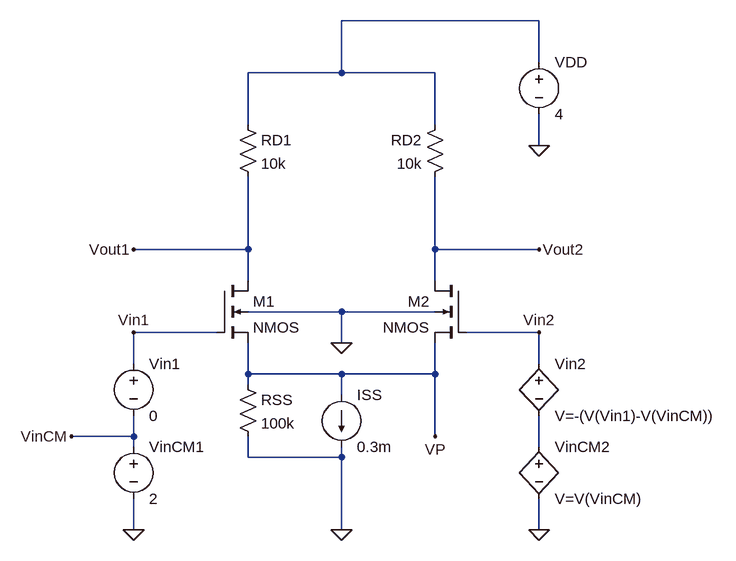
[diagram p0: schematic Chapter04A_02.fig.asc]
Chapter04A_02.fig.asc, the LTspice schematic file:
Version 4
SHEET 1 952 740
WIRE 512 -80 208 -80
WIRE 512 -16 512 -80
WIRE 208 0 208 -80
WIRE 208 0 64 0
WIRE 352 0 208 0
WIRE 64 80 64 0
WIRE 352 80 352 0
WIRE 512 112 512 64
WIRE 64 272 64 160
WIRE 64 272 -112 272
WIRE 352 272 352 160
WIRE 512 272 352 272
WIRE 64 320 64 272
WIRE 352 320 352 272
WIRE 208 368 64 368
WIRE 352 368 208 368
WIRE 16 400 -112 400
WIRE 512 400 400 400
WIRE 208 416 208 368
WIRE -112 448 -112 400
WIRE 512 448 512 400
WIRE 64 464 64 416
WIRE 208 464 64 464
WIRE 352 464 352 416
WIRE 352 464 208 464
WIRE 64 480 64 464
WIRE 208 496 208 464
WIRE -112 560 -112 528
WIRE -112 560 -208 560
WIRE 352 560 352 464
WIRE -112 576 -112 560
WIRE 512 576 512 528
WIRE 64 592 64 560
WIRE 208 592 208 576
WIRE 208 592 64 592
WIRE -112 704 -112 656
WIRE 208 704 208 592
WIRE 512 704 512 656
FLAG -112 704 0
FLAG 512 704 0
FLAG 208 704 0
FLAG 512 272 Vout2
FLAG -112 272 Vout1
FLAG 512 112 0
FLAG 208 416 0
FLAG -112 400 Vin1
FLAG 512 400 Vin2
FLAG -208 560 VinCM
FLAG 352 560 VP
SYMBOL res 48 64 R0
SYMATTR InstName RD1
SYMATTR Value 10k
SYMBOL res 368 64 M0
SYMATTR InstName RD2
SYMATTR Value 10k
SYMBOL nmos4 16 320 R0
SYMATTR InstName M1
SYMBOL nmos4 400 320 M0
SYMATTR InstName M2
SYMBOL voltage 512 -32 R0
WINDOW 123 0 0 Left 0
WINDOW 39 0 0 Left 0
SYMATTR InstName VDD
SYMATTR Value 4
SYMBOL current 208 496 R0
WINDOW 123 0 0 Left 0
WINDOW 39 0 0 Left 0
SYMATTR InstName ISS
SYMATTR Value 0.3m
SYMBOL voltage -112 560 R0
WINDOW 123 0 0 Left 0
WINDOW 39 0 0 Left 0
SYMATTR InstName VinCM1
SYMATTR Value 2
SYMBOL voltage -112 432 R0
SYMATTR InstName Vin1
SYMATTR Value 0
SYMBOL bv 512 560 R0
SYMATTR InstName VinCM2
SYMATTR Value V=V(VinCM)
SYMBOL bv 512 432 R0
SYMATTR InstName Vin2
SYMATTR Value V=-(V(Vin1)-V(VinCM))
SYMBOL res 48 464 R0
SYMATTR InstName RSS
SYMATTR Value 100k

The netlist it stands for:
* Chapter04A_02.fig.asc
RD1 N001 Vout1 10k
RD2 N001 Vout2 10k
M1 Vout1 Vin1 VP 0 NMOS
M2 Vout2 Vin2 VP 0 NMOS
VDD N001 0 4
ISS VP 0 0.3m
VinCM1 VinCM 0 2
Vin1 Vin1 VinCM 0
B§VinCM2 N002 0 V=V(VinCM)
B§Vin2 Vin2 N002 V=-(V(Vin1)-V(VinCM))
RSS VP 0 100k
.model NMOS NMOS
.model PMOS PMOS
.lib standard.mos
.backanno
.end